# Altium schematic sheet 8.SchDoc
size A4; SheetNumber: 2; SheetTotal: 2
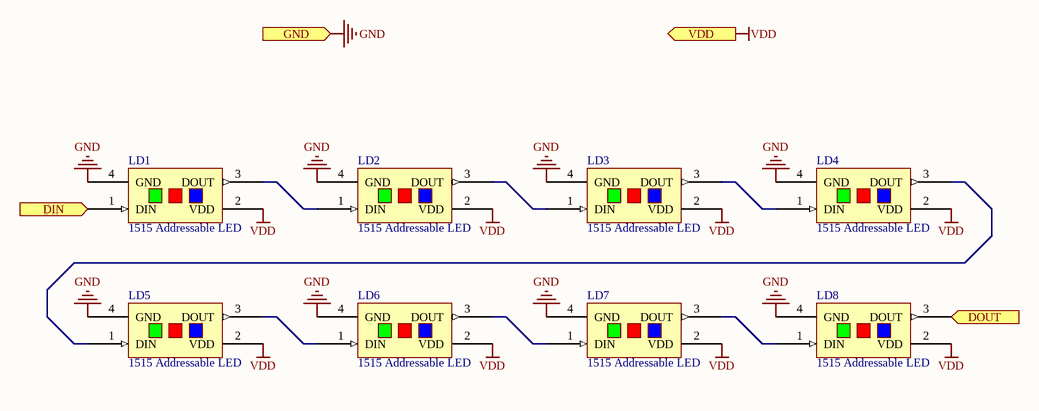
[diagram p0: 8.SchDoc]

## Parts
LD1  1515 Addressable LED  [SK6805-EC 15 DENSE]
LD2  1515 Addressable LED  [SK6805-EC 15 DENSE]
LD3  1515 Addressable LED  [SK6805-EC 15 DENSE]
LD4  1515 Addressable LED  [SK6805-EC 15 DENSE]
LD5  1515 Addressable LED  [SK6805-EC 15 DENSE]
LD6  1515 Addressable LED  [SK6805-EC 15 DENSE]
LD7  1515 Addressable LED  [SK6805-EC 15 DENSE]
LD8  1515 Addressable LED  [SK6805-EC 15 DENSE]

## Ports
DIN (in), DOUT (out), GND, VDD

## Nets
GND: LD1.4(GND) LD2.4(GND) LD3.4(GND) LD4.4(GND) LD5.4(GND) LD6.4(GND) LD7.4(GND) LD8.4(GND) ; port GND
VDD: LD1.2(VDD) LD2.2(VDD) LD3.2(VDD) LD4.2(VDD) LD5.2(VDD) LD6.2(VDD) LD7.2(VDD) LD8.2(VDD) ; port VDD
DIN: LD1.1(DIN) ; port DIN
DOUT: LD8.3(DOUT) ; port DOUT
NetLD1_3: LD1.3(DOUT) LD2.1(DIN)
NetLD2_3: LD2.3(DOUT) LD3.1(DIN)
NetLD3_3: LD3.3(DOUT) LD4.1(DIN)
NetLD4_3: LD4.3(DOUT) LD5.1(DIN)
NetLD5_3: LD5.3(DOUT) LD6.1(DIN)
NetLD6_3: LD6.3(DOUT) LD7.1(DIN)
NetLD7_3: LD7.3(DOUT) LD8.1(DIN)

## Library data of the parts
LD1-LD8 = SK6805-EC 15